# Altium project sft.PrjPCB
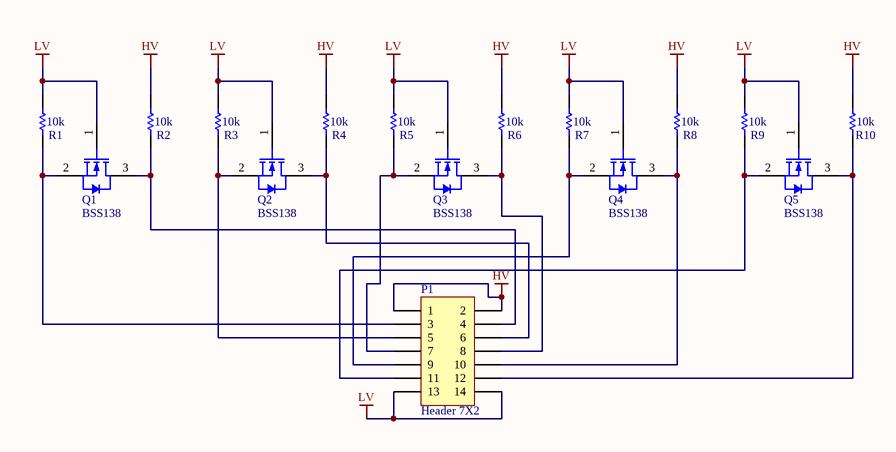
[diagram p0: sft.SchDoc]
ProjectTitle: Five Channel Level Shifter
1 sheet, 16 parts. Net scope: hierarchical (ports join the sheet entries above them; power ports are global).
Board file: sft.PcbDoc

## Sheet sft.SchDoc: Top
size A4; SheetNumber: 1; SheetTotal: 1

### Parts
P1  Header 7X2  [HDR2X7]
Q1  BSS138  [FAIR-SOT23-3_V]
Q2  BSS138  [FAIR-SOT23-3_V]
Q3  BSS138  [FAIR-SOT23-3_V]
Q4  BSS138  [FAIR-SOT23-3_V]
Q5  BSS138  [FAIR-SOT23-3_V]
R1  value 10k  [0603]  (hidden comment: Generic 0603 Resistor)
R2  value 10k  [0603]  (hidden comment: Generic 0603 Resistor)
R3  value 10k  [0603]  (hidden comment: Generic 0603 Resistor)
R4  value 10k  [0603]  (hidden comment: Generic 0603 Resistor)
R5  value 10k  [0603]  (hidden comment: Generic 0603 Resistor)
R6  value 10k  [0603]  (hidden comment: Generic 0603 Resistor)
R7  value 10k  [0603]  (hidden comment: Generic 0603 Resistor)
R8  value 10k  [0603]  (hidden comment: Generic 0603 Resistor)
R9  value 10k  [0603]  (hidden comment: Generic 0603 Resistor)
R10  value 10k  [0603]  (hidden comment: Generic 0603 Resistor)

### Nets
HV: P1.1 P1.2 R2.2 R4.2 R6.2 R8.2 R10.2
LV: P1.13 P1.14 Q1.1(G) Q2.1(G) Q3.1(G) Q4.1(G) Q5.1(G) R1.2 R3.2 R5.2 R7.2 R9.2
NetP1_3: P1.3 Q1.2(S) R1.1
NetP1_4: P1.4 Q1.3(D) R2.1
NetP1_5: P1.5 Q2.2(S) R3.1
NetP1_6: P1.6 Q2.3(D) R4.1
NetP1_7: P1.7 Q3.2(S) R5.1
NetP1_8: P1.8 Q3.3(D) R6.1
NetP1_9: P1.9 Q4.2(S) R7.1
NetP1_10: P1.10 Q4.3(D) R8.1
NetP1_11: P1.11 Q5.2(S) R9.1
NetP1_12: P1.12 Q5.3(D) R10.1

### Notes on the sheet
- Title
- Title:
- Project:
- Size:
- Date:
- File:
- E
- Number:
- Time:
- Revision:
- Sheet
- of

### Library data of the parts
P1 = Header 7X2: Header, 7-Pin, Dual row; LatestRevisionDate: 17-Jul-2002; LatestRevisionNote: Re-released for DXP Platform.; Publisher: Altium Limited
Q1-Q5 = BSS138: N-Channel Logic Level Enhancement Mode Field Effect Transistor, 220 mA, 50 V, -55 to 150 degC, 3-Pin SOT-23, RoHS, Tape and Reel; ESR: 40 Ohm; Tolerance: 30ppm; Capacitance: 1.8E-11 f; Load Capacitance: 18 pF; Frequency: 12 MHz; Resistance: 100 Ohm; Min Operating Temperature: -20degC; ComponentLink2URL: https://www.fairchildsemi.com/datasheets/BS/BSS138.pdf; Max Operating Temperature: 70degC; Width: 0.126 inch; Pins: 4; Length: 0.197 inch; ComponentLink2Description: Datasheet; Package Quantity: 1; PackageReference: SOT23-3; Packaging: Tape and Reel; RoHSCompliant: True; Frequency Tolerance: 30ppm; ComponentLink3Description: Package Specification; Mount: Surface Mount; REACH SVHC: Unknown; Height: 0.041 inch; ComponentLink1URL: https://www.fairchildsemi.com/; PackageDescription: 3-Pin Small Outline Transistor, Body 2.92 x 1.325 mm, Pitch 0.95 mm; ComponentLink3URL: http://www.fairchildsemi.com/dwg/MA/MA03D.pdf; ComponentLink1Description: Manufacturer URL; DatasheetVersion: Rev. C, 10/2005
R1-R10 = R_0603: Specifications: *